# Altium schematic sheet DS18B20.SchDoc
size A4
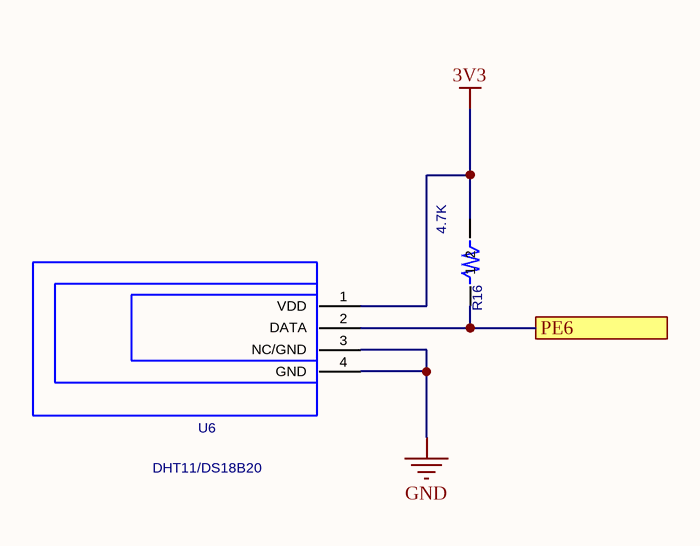
[diagram p0: DS18B20.SchDoc]

## Parts
R16  value 4.7K  [RES_0603_FIRE]  (hidden comment: RES_4K7_0603_FIRE)
U6  DHT11/DS18B20  [HDR1X4]

## Ports
PE6

## Nets
3V3: R16.2 U6.1(VDD)
GND: U6.3(NC/GND) U6.4(GND)
PE6: R16.1 U6.2(DATA) ; port PE6

## Library data of the parts
R16 = RES_4K7_0603_FIRE: 0402; Manufacture 1: SUPEROHM; Tolerance: +-5%; PCB DECAL: RES_0603_FIRE
U6 = DHT11/DS18B20: Manufacture 1 P/N: DHT11/DS1302; PCB DECAL: HDR1X4